# Altium project MindControlledCarPCB.PrjPcb
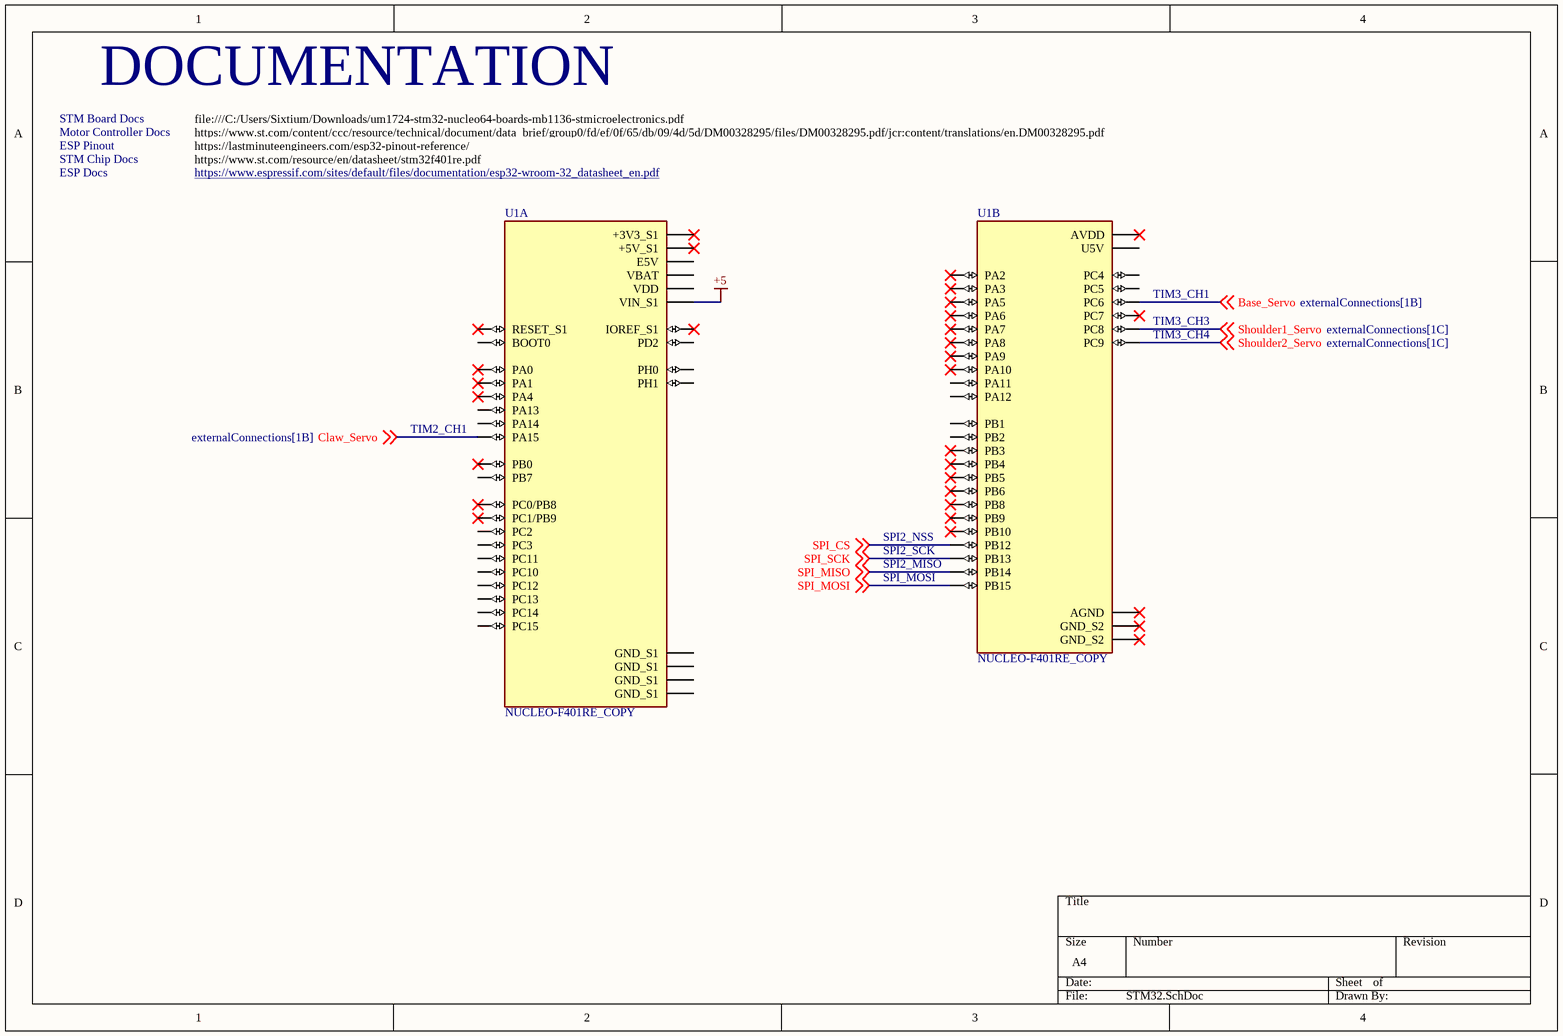
[diagram p0: STM32.SchDoc]
3 sheets, 8 parts. Net scope: global (net labels, ports and power ports of the same name join across sheets).
Board file: MindControlledCarPCB.PcbDoc
Sheets:
  STM32.SchDoc
  ESP32.SchDoc
  externalConnections.SchDoc

## Sheet STM32.SchDoc
size A4; SheetNumber: 1; SheetTotal: 3

### Parts
U1  NUCLEO-F401RE_COPY  [ST_NUCLEO-F401RE - COPY]  (parts A,B of 2)

### Nets
+5: U1.CN7_24(VIN_S1)
Base_Servo: U1.CN10_4(PC6) ; off-sheet Base_Servo
Claw_Servo: U1.CN7_17(PA15) ; off-sheet Claw_Servo
Shoulder1_Servo: U1.CN10_2(PC8) ; off-sheet Shoulder1_Servo
Shoulder2_Servo: U1.CN10_1(PC9) ; off-sheet Shoulder2_Servo
SPI_CS: U1.CN10_16(PB12) ; off-sheet SPI_CS
SPI_MISO: U1.CN10_28(PB14) ; off-sheet SPI_MISO
SPI_MOSI: U1.CN10_26(PB15) ; off-sheet SPI_MOSI
SPI_SCK: U1.CN10_30(PB13) ; off-sheet SPI_SCK

Not connected (* = marked no-connect by the designer): U1 CN7_1(PC10) CN7_2(PC11) CN7_3(PC12) CN7_4(PD2) CN7_5(VDD) CN7_6(E5V) CN7_7(BOOT0) CN7_8(GND_S1) CN7_12(IOREF_S1)* CN7_13(PA13) CN7_14(RESET_S1)* CN7_15(PA14) CN7_16(+3V3_S1)* CN7_18(+5V_S1)* CN7_19(GND_S1) CN7_20(GND_S1) CN7_21(PB7) CN7_22(GND_S1) CN7_23(PC13) CN7_25(PC14) CN7_27(PC15) CN7_28(PA0)* CN7_29(PH0) CN7_30(PA1)* CN7_31(PH1) CN7_32(PA4)* CN7_33(VBAT) CN7_34(PB0)* CN7_35(PC2) CN7_36(PC1/PB9)* CN7_37(PC3) CN7_38(PC0/PB8)* CN10_3(PB8)* CN10_5(PB9)* CN10_6(PC5) CN10_7(AVDD)* CN10_8(U5V) CN10_9(GND_S2)* CN10_11(PA5)* CN10_12(PA12) CN10_13(PA6)* CN10_14(PA11) CN10_15(PA7)* CN10_17(PB6)* CN10_19(PC7)* CN10_20(GND_S2)* CN10_21(PA9)* CN10_22(PB2) CN10_23(PA8)* CN10_24(PB1) CN10_25(PB10)* CN10_27(PB4)* CN10_29(PB5)* CN10_31(PB3)* CN10_32(AGND)* CN10_33(PA10)* CN10_34(PC4) CN10_35(PA2)* CN10_37(PA3)*

### Notes on the sheet
- DOCUMENTATION
- STM Chip Docs
- STM Board Docs
- Motor Controller Docs
- ESP Pinout
- ESP Docs
- file:///C:/Users/Sixtium/Downloads/um1724-stm32-nucleo64-boards-mb1136-stmicroelectronics.pdf
- https://www.st.com/content/ccc/resource/technical/document/data_brief/group0/fd/ef/0f/65/db/09/4d/5d/DM00328295/files/DM00328295.pdf/jcr:content/translations/en.DM00328295.pdf
- https://lastminuteengineers.com/esp32-pinout-reference/
- https://www.st.com/resource/en/datasheet/stm32f401re.pdf
- https://www.espressif.com/sites/default/files/documentation/esp32-wroom-32_datasheet_en.pdf
- (near U1) TIM3_CH1
- (near U1) TIM3_CH3
- (near U1) TIM3_CH4
- (near U1) TIM2_CH1
- (near U1) SPI2_NSS
- (near U1) SPI2_SCK
- (near U1) SPI2_MISO
- (near U1) SPI_MOSI

### Library data of the parts
U1 = NUCLEO-F401RE_COPY: STM32 Nucleo-64 development board with STM32F401RET6 MCU, supports Arduino and ST morpho connectivity; Availability: Unavailable; Price: None; Package: None; MP: NUCLEO-F401RE; Value: *

## Sheet ESP32.SchDoc
size A4; SheetNumber: 2; SheetTotal: 3
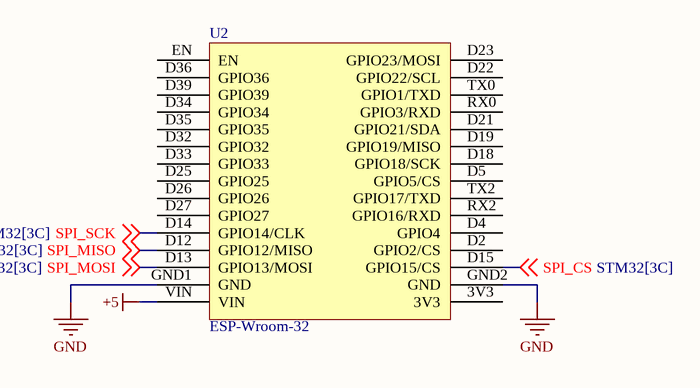
[diagram p1: ESP32.SchDoc]

### Parts
U2  ESP-Wroom-32  [MODULE_ESP32_DEVKIT_V1]

### Nets
+5: U2.VIN
GND: U2.GND1(GND) U2.GND2(GND)
SPI_CS: U2.D15(GPIO15/CS) ; off-sheet SPI_CS
SPI_MISO: U2.D12(GPIO12/MISO) ; off-sheet SPI_MISO
SPI_MOSI: U2.D13(GPIO13/MOSI) ; off-sheet SPI_MOSI
SPI_SCK: U2.D14(GPIO14/CLK) ; off-sheet SPI_SCK

Not connected (* = marked no-connect by the designer): U2 3V3 D2(GPIO2/CS) D4(GPIO4) D5(GPIO5/CS) D18(GPIO18/SCK) D19(GPIO19/MISO) D21(GPIO21/SDA) D22(GPIO22/SCL) D23(GPIO23/MOSI) D25(GPIO25) D26(GPIO26) D27(GPIO27) D32(GPIO32) D33(GPIO33) D34(GPIO34) D35(GPIO35) D36(GPIO36) D39(GPIO39) EN RX0(GPIO3/RXD) RX2(GPIO16/RXD) TX0(GPIO1/TXD) TX2(GPIO17/TXD)

### Library data of the parts
U2 = ESP-Wroom-32: https://lastminuteengineers.com/esp32-pinout-reference/; pin to pad: 3V3>16 D2>19 D4>20 D5>23 D12>12 D13>13 D14>11 D15>18 D18>24 D19>25 D21>26 D22>29 D23>30 D25>8 D26>9 D27>10 D32>6 D33>7 D34>4 D35>5 D36>2 D39>3 EN>1 GND1>14 GND2>17 RX0>27 RX2>21 TX0>28 TX2>22 VIN>15

## Sheet externalConnections.SchDoc
size A4; SheetNumber: 3; SheetTotal: 3
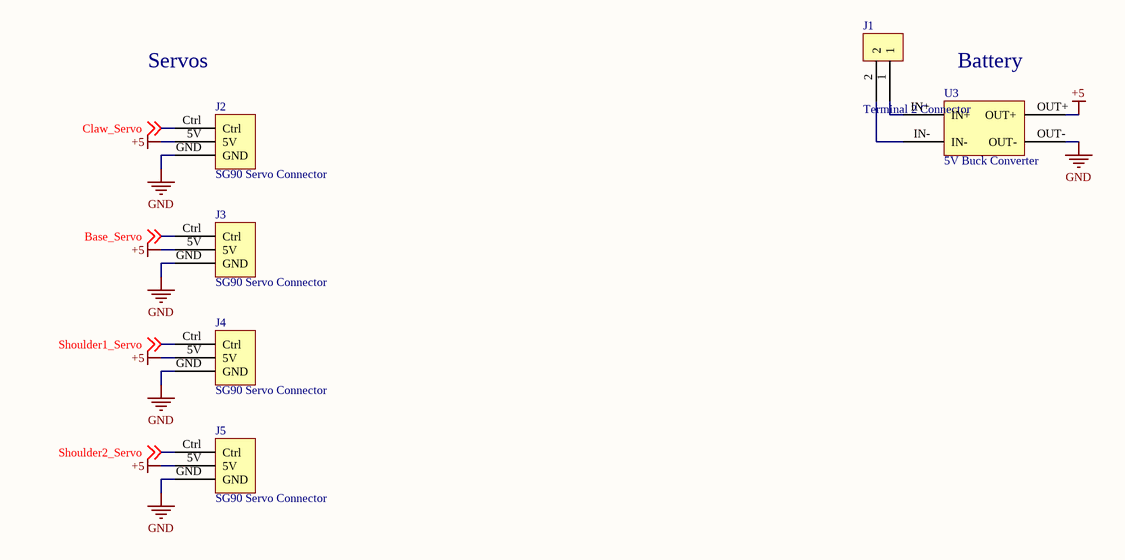
[diagram p2: externalConnections.SchDoc]

### Parts
J1  Terminal 2 Connector  [Terminal 2 Connector]
J2  SG90 Servo Connector  [SG90 Servo Connector]
J3  SG90 Servo Connector  [SG90 Servo Connector]
J4  SG90 Servo Connector  [SG90 Servo Connector]
J5  SG90 Servo Connector  [SG90 Servo Connector]
U3  5V Buck Converter  [5V Buck Converter]

### Nets
+5: J2.5V J3.5V J4.5V J5.5V U3.OUT+
GND: J2.GND J3.GND J4.GND J5.GND U3.OUT-
Base_Servo: J3.Ctrl ; off-sheet Base_Servo
Claw_Servo: J2.Ctrl ; off-sheet Claw_Servo
Shoulder1_Servo: J4.Ctrl ; off-sheet Shoulder1_Servo
Shoulder2_Servo: J5.Ctrl ; off-sheet Shoulder2_Servo
NetJ1_1: J1.1 U3.IN+
NetJ1_2: J1.2 U3.IN-

### Notes on the sheet
- Servos
- (near U3) Battery

### Library data of the parts
J1 = Terminal 2 Connector: https://jlcpcb.com/partdetail/Ningbo_KangnexElec-WJ500V_5_082P/C8465
U3 = 5V Buck Converter: https://www.amazon.ca/Converter-Ajustable-Step-down-Converters-1-25V-35V/dp/B074J4DLWQ/ref=asc_df_B074J4DLWQ/?tag=googleshopc0c-20&linkCode=df0&hvadid=335365451913&hvpos=&hvnetw=g&hvrand=5299524130222726720&hvpone=&hvptwo=&hvqmt=&hvdev=c&hvdvcmdl=&hvlocint=&hvlocphy=9001318&hvtargid=pla-899437512675&psc=1

## Nets that join several sheets
+5: STM32 (U1.CN7_24), ESP32 (U2.VIN), externalConnections (5 pins)
GND: ESP32 (U2.GND1 U2.GND2), externalConnections (5 pins)
Base_Servo: STM32 (U1.CN10_4), externalConnections (J3.Ctrl)
Claw_Servo: STM32 (U1.CN7_17), externalConnections (J2.Ctrl)
Shoulder1_Servo: STM32 (U1.CN10_2), externalConnections (J4.Ctrl)
Shoulder2_Servo: STM32 (U1.CN10_1), externalConnections (J5.Ctrl)
SPI_CS: STM32 (U1.CN10_16), ESP32 (U2.D15)
SPI_MISO: STM32 (U1.CN10_28), ESP32 (U2.D12)
SPI_MOSI: STM32 (U1.CN10_26), ESP32 (U2.D13)
SPI_SCK: STM32 (U1.CN10_30), ESP32 (U2.D14)